# Altium schematic sheet Top_Level.SchDoc
size 297 x 209 mm; SheetNumber: 1; SheetTotal: 11
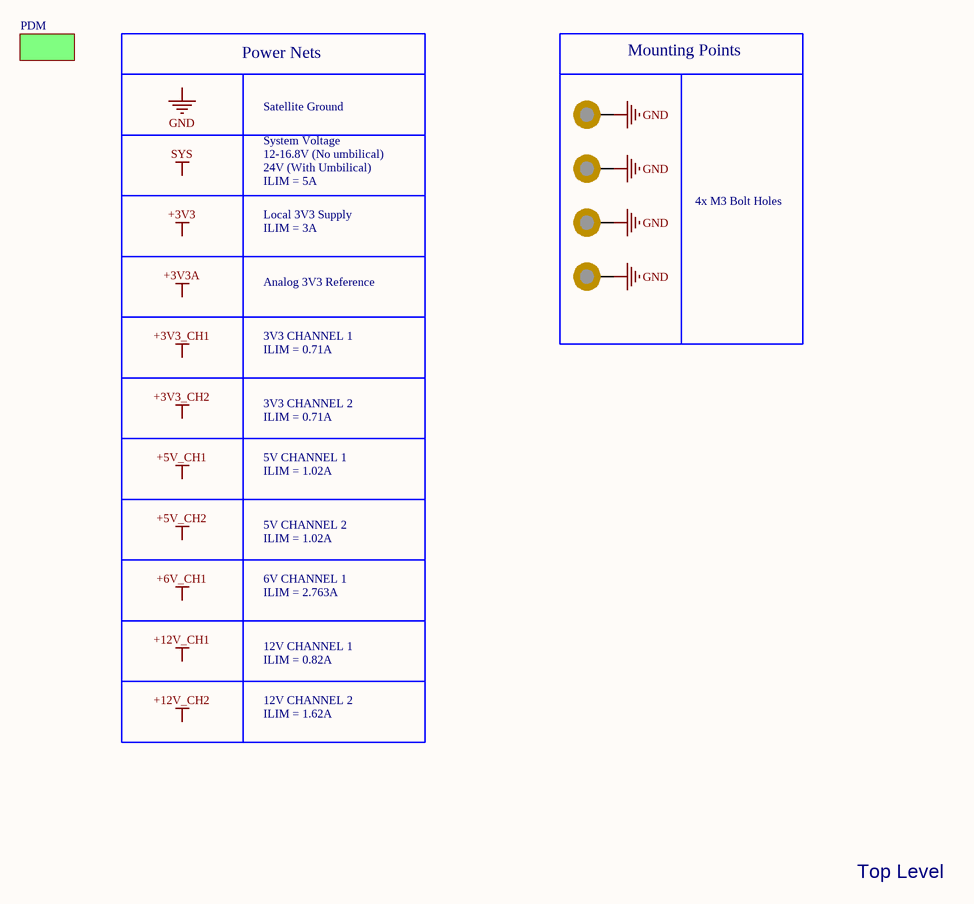
[diagram p0: Top_Level.SchDoc]

## Parts
MECH1  M3 Mounting Hole  [M3 Mounting Hole]  (value not drawn)  (no BOM)
MECH2  M3 Mounting Hole  [M3 Mounting Hole]  (value not drawn)  (no BOM)
MECH3  M3 Mounting Hole  [M3 Mounting Hole]  (value not drawn)  (no BOM)
MECH4  M3 Mounting Hole  [M3 Mounting Hole]  (value not drawn)  (no BOM)

## Sub-sheets
PDM = PDM: no entries

## Nets
GND: MECH1.1 MECH2.1 MECH3.1 MECH4.1

## Notes on the sheet
- Power Nets
- Mounting Points
- Satellite Ground
- System Voltage
- 12-16.8V (No umbilical)
- 24V (With Umbilical)
- ILIM = 5A
- Local 3V3 Supply
- ILIM = 3A
- 4x M3 Bolt Holes
- Analog 3V3 Reference
- 3V3 CHANNEL 1
- ILIM = 0.71A
- 3V3 CHANNEL 2
- 5V CHANNEL 1
- ILIM = 1.02A
- 5V CHANNEL 2
- 6V CHANNEL 1
- ILIM = 2.763A
- 12V CHANNEL 1
- ILIM = 0.82A
- 12V CHANNEL 2
- ILIM = 1.62A
- Top Level
- Labels drawn without touching a wire or pin: +3V3, +3V3_CH1, +3V3_CH2, +3V3A, +5V_CH1, +5V_CH2, +6V_CH1, +12V_CH1, +12V_CH2, GND, SYS
- Size:
- Title:
- A4
- Project:
- Rev:
- Date:
- Drawn By:
- Sheet:
- of